# Altium schematic sheet FRAM.SchDoc: FRAM Memory
size A3; DocumentNumber: 15; SheetNumber: 15; SheetTotal: 16; Model: EM1; PageSetup: Record=PageOptions|CenterHorizontal=True|CenterVertical=True|PrintScale=0.52|XCorrection=1.00|YCorrection=1.00|PrintKind=1|BorderSize=5000000|LeftOffset=0|BottomOffset=0|Orientation=2|PaperLength=4200|PaperWidth=2970|Scale=100|PaperSource=7|PrintQuality=600|MediaType=1|DitherType=10|PaperKind=A3|PrintScaleMode=1
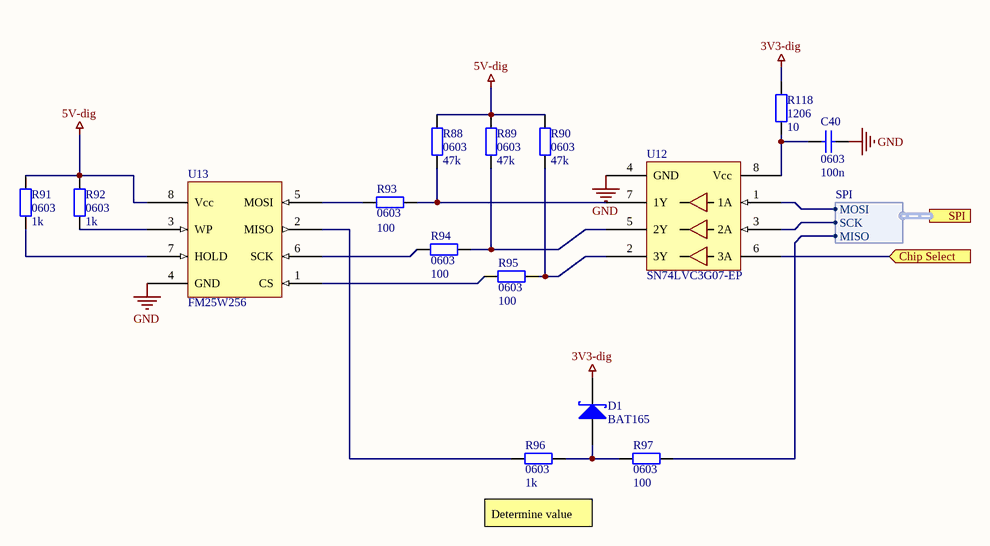
[diagram p0: FRAM.SchDoc]

## Parts
C40  0603  value 100n  [SMD_Capacitor_0603]
D1  BAT165  [SOD323]
R88  0603  value 47k  [SMD_Resistor_0603]
R89  0603  value 47k  [SMD_Resistor_0603]
R90  0603  value 47k  [SMD_Resistor_0603]
R91  0603  value 1k  [SMD_Resistor_0603]
R92  0603  value 1k  [SMD_Resistor_0603]
R93  0603  value 100  [SMD_Resistor_0603]
R94  0603  value 100  [SMD_Resistor_0603]
R95  0603  value 100  [SMD_Resistor_0603]
R96  0603  value 1k  [SMD_Resistor_0603]
R97  0603  value 100  [SMD_Resistor_0603]
R118  1206  value 10  [SMD_Resistor_1206]
U12  SN74LVC3G07-EP  [VSSOP-8]
U13  FM25W256  [SOIC-8-N]

## Ports
Chip Select (in), SPI (harness SPI)

## Harnesses
SPI: MOSI, MISO, SCK

## Nets
3V3-dig: D1.K R118.1
5V-dig: R88.2 R89.2 R90.2 R91.2 R92.2 U13.8(Vcc)
GND: C40.1 U12.4(GND) U13.4(GND)
Chip Select: U12.6(3A) ; port Chip Select
NetC40_2: C40.2 R118.2 U12.8(Vcc)
NetD1_A: D1.A R96.1 R97.2
NetR88_1: R88.1 R93.1 U12.7(1Y)
NetR89_1: R89.1 R94.1 U12.5(2Y)
NetR90_1: R90.1 R95.1 U12.2(3Y)
NetR91_1: R91.1 U13.7(HOLD)
NetR92_1: R92.1 U13.3(WP)
NetR93_2: R93.2 U13.5(MOSI)
NetR94_2: R94.2 U13.6(SCK)
NetR95_2: R95.2 U13.1(CS)
NetR96_2: R96.2 U13.2(MISO)
NetR97_1: R97.1 ; port SPI.MISO
NetU12_1: U12.1(1A) ; port SPI.MOSI
NetU12_3: U12.3(2A) ; port SPI.SCK

## Notes on the sheet
- Determine value
- Title:
- Sheet:
- of
- Author:
- Model:
- Document Number:
- Checked by:
- Iss-Rev:
- Approved by:
- Date:
- File name:

## Library data of the parts
C40 = Cap1: Capacitor; Published: 8-Jun-2000; LatestRevisionDate: 17-Jul-2002; LatestRevisionNote: Re-released for DXP Platform.; PackageReference: RAD-0.3; Publisher: Altium Limited; PackageDescription: Radial Cap, Thru-Hole; 2 Leads; 0.3 in Pin Spacing
D1 = BAT165: Madium Power AF Schottky 750mA 40V Diode; Manufacturer: Infineon; Value: BAT165
R88-R97 R118 = Res2: Resistor; Published: 8-Jun-2000; LatestRevisionDate: 17-Jul-2002; LatestRevisionNote: Re-released for DXP Platform.; PackageReference: AXIAL-0.4; Publisher: Altium Limited; PackageDescription: Axial Device, Thru-Hole; 2 Leads; 0.4 in Pin Spacing
U12 = SN74LVC3G07-EP: Triple Buffer/Driver With Open-Drain Output
U13 = FM25W256: 256Kb (8k x 32) SPI F-RAM